# EAGLE design GPS_timing module (EAGLE 7.2.0)
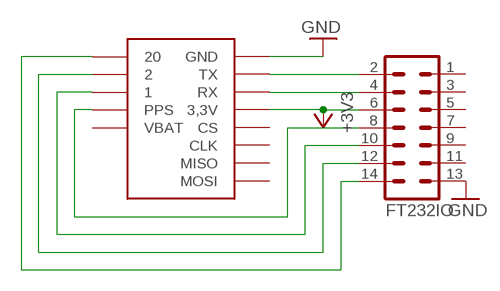
[diagram p0: schematic, sheet 1]

## Parts
FT232IO  MA07-2  [MA07-2]
U$2  GPS  [GPS]

## Nets
+3V3: FT232IO.6 U$2.P$4(3,3V)
GND: FT232IO.13 U$2.P$1(GND)
N$1: FT232IO.8 U$2.P$12(PPS)
N$2: FT232IO.2 U$2.P$2(TX)
N$3: FT232IO.4 U$2.P$3(RX)
N$4: FT232IO.10 U$2.P$11
N$5: FT232IO.12 U$2.P$10
N$6: FT232IO.14 U$2.P$9
Unconnected: FT232IO.1 FT232IO.3 FT232IO.5 FT232IO.7 FT232IO.9 FT232IO.11 U$2.P$5(CS) U$2.P$6(CLK) U$2.P$7(MISO) U$2.P$8(MOSI) U$2.P$13(VBAT)

## Library data of the parts
FT232IO = con-lstb:MA07-2: PIN HEADER; OC_FARNELL: unknown; OC_NEWARK: unknown
U$2 = module_library:GPS

## Board
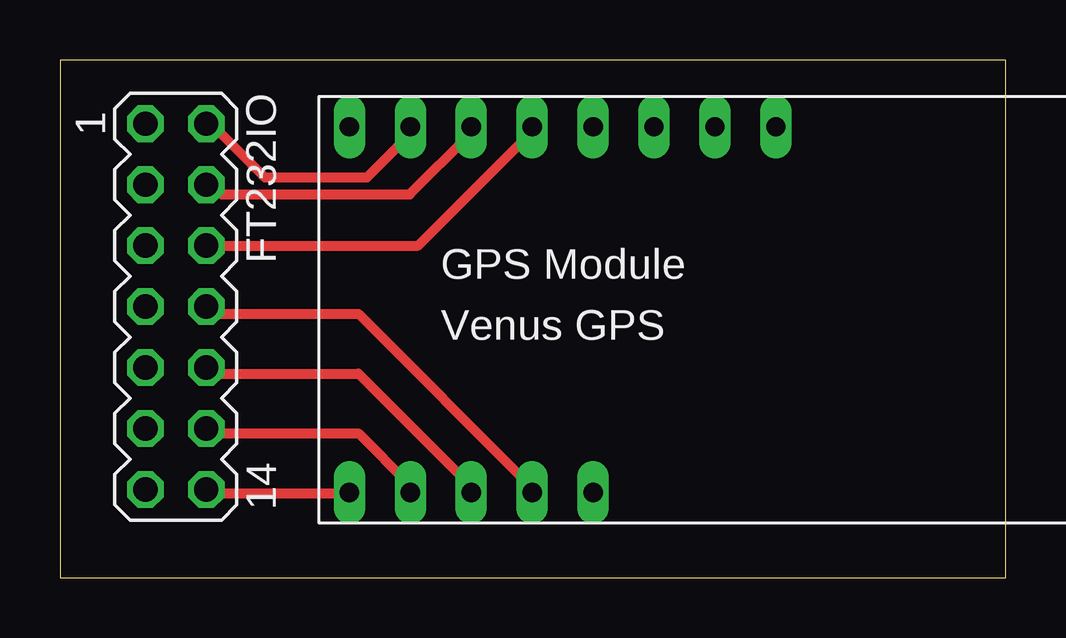
[diagram p1: board, top side]
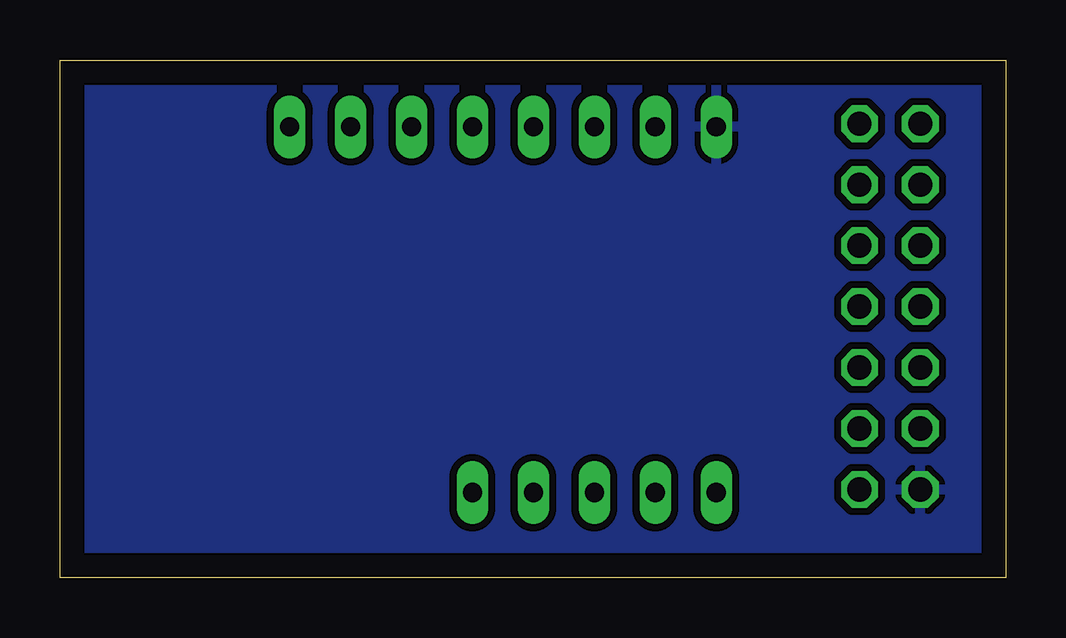
[diagram p2: board, bottom side, seen from below]

Size 39.42 x 21.58 mm. Coordinates in mm from the lower left corner, seen from the top.
Outline: 0,0 39.42,0 39.42,21.58 0,21.58 0,0
Copper layers (1*16): Top 0.035mm / dielectric 1.5mm / Bottom 0.035mm
Design rules "default *": minimum track width 16mil, minimum drill 24mil, track to track 12mil, track to pad 12mil, pad to pad 8mil, via to via 8mil, smd to smd 8mil, copper to edge 40mil, drill to drill 8mil, minimum pad ring 10mil, minimum via ring 8mil, stop-mask expansion 4mil, vias tented up to drill 0mil, thermal gap 10mil

### Footprints (pad centres in the part's own frame; a part is rotated, then mirrored left to right if it is on the bottom)
MA07-2 = drill 1.016 octagon: 1 -7.62,-1.27; 2 -7.62,1.27; 3 -5.08,-1.27; 4 -5.08,1.27; 5 -2.54,-1.27; 6 -2.54,1.27; 7 0,-1.27; 8 0,1.27; 9 2.54,-1.27; 10 2.54,1.27; 11 5.08,-1.27; 12 5.08,1.27; 13 7.62,-1.27; 14 7.62,1.27
GPS = drill 0.8 long: P$1 -15.24,6.35; P$2 -12.7,6.35; P$3 -10.16,6.35; P$4 -7.62,6.35; P$5 -5.08,6.35; P$6 -2.54,6.35; P$7 0,6.35; P$8 2.54,6.35; P$9 -15.24,-8.89; P$10 -12.7,-8.89; P$11 -10.16,-8.89; P$12 -7.62,-8.89; P$13 -5.08,-8.89

### Placement (x,y rotation side)
FT232IO  4.83,11.3 270 top
U$2  27.3,12.45 0 top

### Tracks (layer width: path | path; a pad name or v marks a point on that pad's centre or on a via)
+3V3
  Top 0.406: FT232IO.6 14.94,13.84 19.56,18.47 U$2.P$4
GND
  pour Bottom (isolate 0.305): 0,22.35 45.59,21.84 45.59,0.89 0,0.76
N$1
  Top 0.406: U$2.P$12 19.56,3.89 12.45,11 6.4,11 FT232IO.8
N$2
  Top 0.406: U$2.P$2 14.58,18.47 12.8,16.69 8.53,16.69 6.4,18.82 FT232IO.2
N$3
  Top 0.406: U$2.P$3 17.07,18.47 14.58,15.98 6.76,15.98 6.4,16.33 FT232IO.4
N$4
  Top 0.406: U$2.P$11 17.07,3.89 12.45,8.51 6.4,8.51 FT232IO.10
N$5
  Top 0.406: U$2.P$10 14.58,3.89 12.45,6.02 6.4,6.02 FT232IO.12
N$6
  Top 0.406: U$2.P$9 11.73,3.53 6.4,3.53 FT232IO.14